# EAGLE design Power (EAGLE 7.3.0)
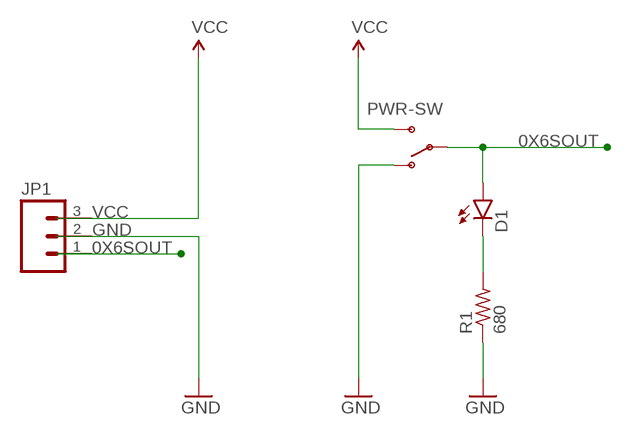
[diagram p0: schematic, sheet 1]

## Parts
D1  LED3MM  [LED3MM]
JP1  M03PTH  [1X03]
PWR-SW  SWITCH-SPDTPTH  [SWITCH-SPDT]
R1  680  R-US_R0603  [R0603]

## Nets
0X6SOUT: D1.A JP1.1 PWR-SW.2(P)
CUR-LIMIT-LED: D1.K(C) R1.2
GND: JP1.2 PWR-SW.1(O) R1.1
VCC: JP1.3 PWR-SW.3(S)

## Library data of the parts
D1 = SparkFun-LED:LED: LEDs Standard schematic elements and footprints for 5mm, 3mm, 1206, and 0603 sized LEDs. 5mm - Spark Fun Electronics SKU : COM-00529 (and others)
JP1 = SparkFun-Connectors:M03: Header 3 Standard 3-pin 0.1" header. Use with straight break away headers (SKU : PRT-00116), right angle break away headers (PRT-00553), swiss pins (PRT-00743), machine pins (PRT-00117), and female headers (PRT-00115). Molex polarized connector foot print use with SKU : PRT-08232 with associated crimp pins and housings.
PWR-SW = SparkFun-Electromechanical:SWITCH-SPDT: SPDT Switch Simple slide switch, Spark Fun Electronics SKU : COM-00102 DPDT SMT slide switch, AYZ0202, SWCH-08179; PROD_ID: SWCH-08261
R1 = adafruit:R-US_: RESISTOR, American symbol

## Board
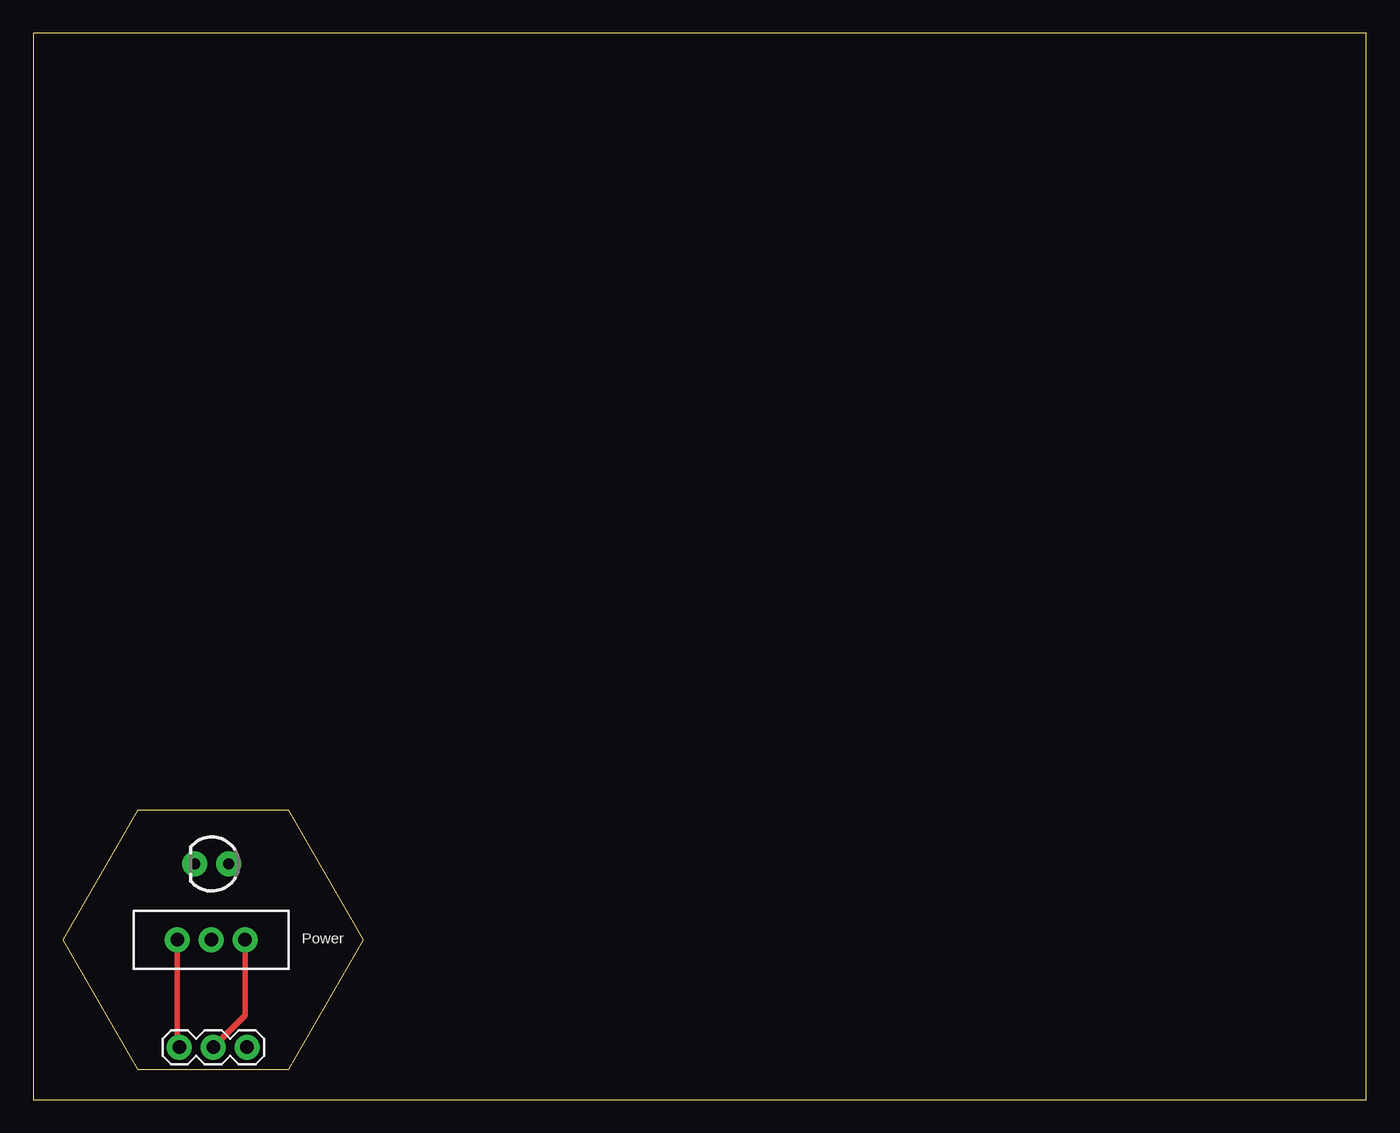
[diagram p1: board, top side]
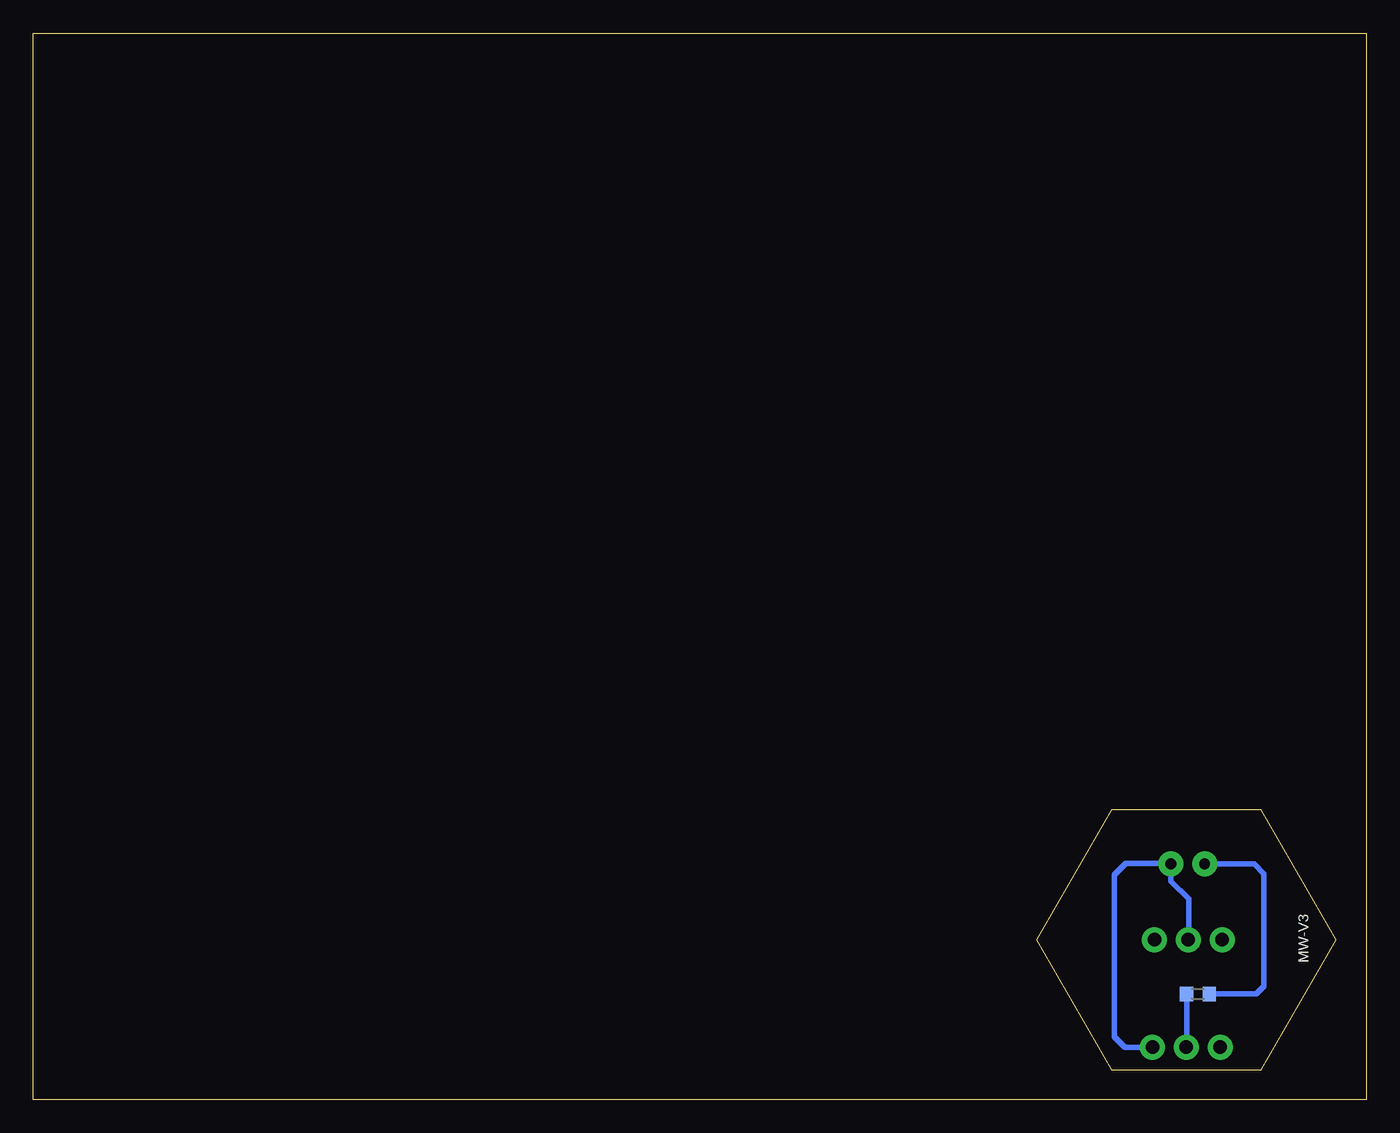
[diagram p2: board, bottom side, seen from below]

Size 100 x 80 mm. Coordinates in mm from the lower left corner, seen from the top.
Outline: 0,0 100,0 100,80 0,80 0,0
Outline: 24.76,11.97 19.13,2.23 7.88,2.23 2.26,11.97 7.88,21.71 19.13,21.71 24.76,11.97
Copper layers (1*16): Top 0.035mm / dielectric 1.5mm / Bottom 0.035mm
Design rules "default": minimum track width 10mil, minimum drill 24mil, track to track 8mil, track to pad 8mil, pad to pad 8mil, via to via 8mil, smd to smd 8mil, copper to edge 40mil, drill to drill 8mil, minimum pad ring 10mil, minimum via ring 8mil, stop-mask expansion 4mil, vias tented up to drill 0mil, thermal gap 10mil

### Footprints (pad centres in the part's own frame; a part is rotated, then mirrored left to right if it is on the bottom)
LED3MM = drill 0.813 pad 1.88: A -1.27,0; K 1.27,0
1X03 = drill 1.016 pad 1.88: 1 0,0; 2 2.54,0; 3 5.08,0
SWITCH-SPDT = drill 1.016 pad 1.88: 1 0,2.54; 2 0,0; 3 0,-2.54
R0603 = smd 1 x 1.1: 1 -0.85,0; 2 0.85,0

### Placement (x,y rotation side)
D1  13.39,17.68 180 top
JP1  16.04,3.93 180 top
PWR-SW  13.35,11.99 270 top
R1  12.62,7.92 0 bottom

### Tracks (layer width: path | path; a pad name or v marks a point on that pad's centre or on a via)
0X6SOUT
  Bottom 0.4: PWR-SW.2 13.32,12.02 13.32,15.05 14.66,16.39 D1.A 14.71,17.73 18.05,17.73 18.9,16.88 18.9,4.72 18.11,3.93 JP1.1
CUR-LIMIT-LED
  Bottom 0.4: R1.2 8.25,7.92 7.67,8.5 7.67,16.95 8.4,17.68 D1.K
GND
  Top 0.4: PWR-SW.1 15.89,6.32 JP1.2
  Bottom 0.4: R1.1 13.47,3.96 JP1.2
VCC
  Top 0.4: PWR-SW.3 10.81,4.08 JP1.3

### Text on the board
tPlace: Power
bPlace: MW-V3